# Altium schematic sheet SWD.SchDoc
size A4
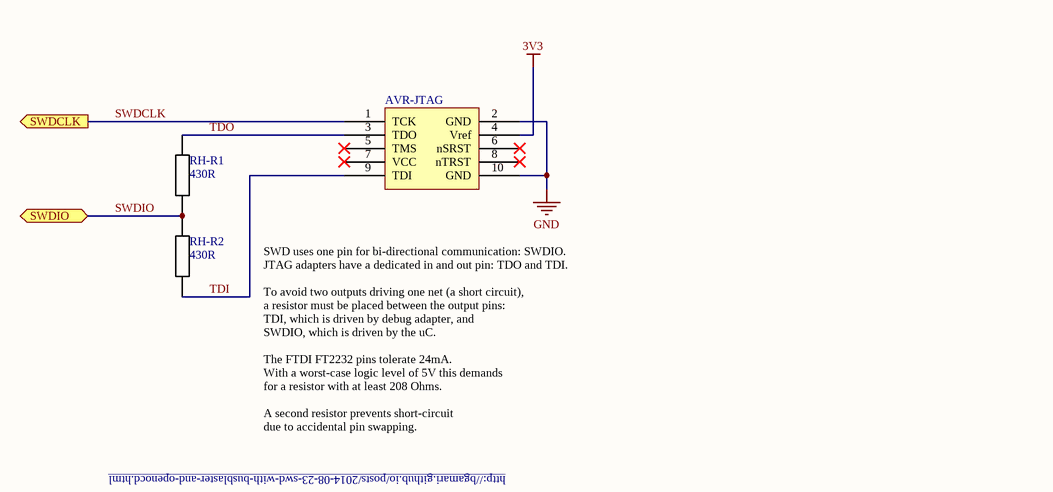
[diagram p0: SWD.SchDoc]

## Parts
AVR-JTAG  AVR Style  [Header 2x5 IDC SMT]  (value not drawn)
RH-R1  430R  [R 0805 / 2012 wide]
RH-R2  430R  [R 0805 / 2012 wide]

## Ports
SWDCLK (out), SWDIO (bidir)

## Nets
3V3: AVR-JTAG.4(Vref)
GND: AVR-JTAG.2(GND) AVR-JTAG.10(GND)
SWDCLK: AVR-JTAG.1(TCK) ; port SWDCLK
SWDIO: RH-R1.1 RH-R2.2 ; port SWDIO
TDI: AVR-JTAG.9(TDI) RH-R2.1
TDO: AVR-JTAG.3(TDO) RH-R1.2

Not connected (* = marked no-connect by the designer): AVR-JTAG 5(TMS)* 6(nSRST)* 7(VCC)* 8(nTRST)*

## Notes on the sheet
- SWD uses one pin for bi-directional communication: SWDIO.
  JTAG adapters have a dedicated in and out pin: TDO and TDI.
  To avoid two outputs driving one net (a short circuit),
  a resistor must be placed between the output pins:
  TDI, which is driven by debug adapter, and
  SWDIO, which is driven by the uC.
  The FTDI FT2232 pins tolerate 24mA.
  With a worst-case logic level of 5V this demands
  for a resistor with at least 208 Ohms.
  A second resistor prevents short-circuit
  due to accidental pin swapping.
- http://bgamari.github.io/posts/2014-08-23-swd-with-busblaster-and-openocd.html

## Library data of the parts
AVR-JTAG = Header JTAG AVR
RH-R1 RH-R2 = Resistor